# Altium project Project_2_BopIt.PrjPcb
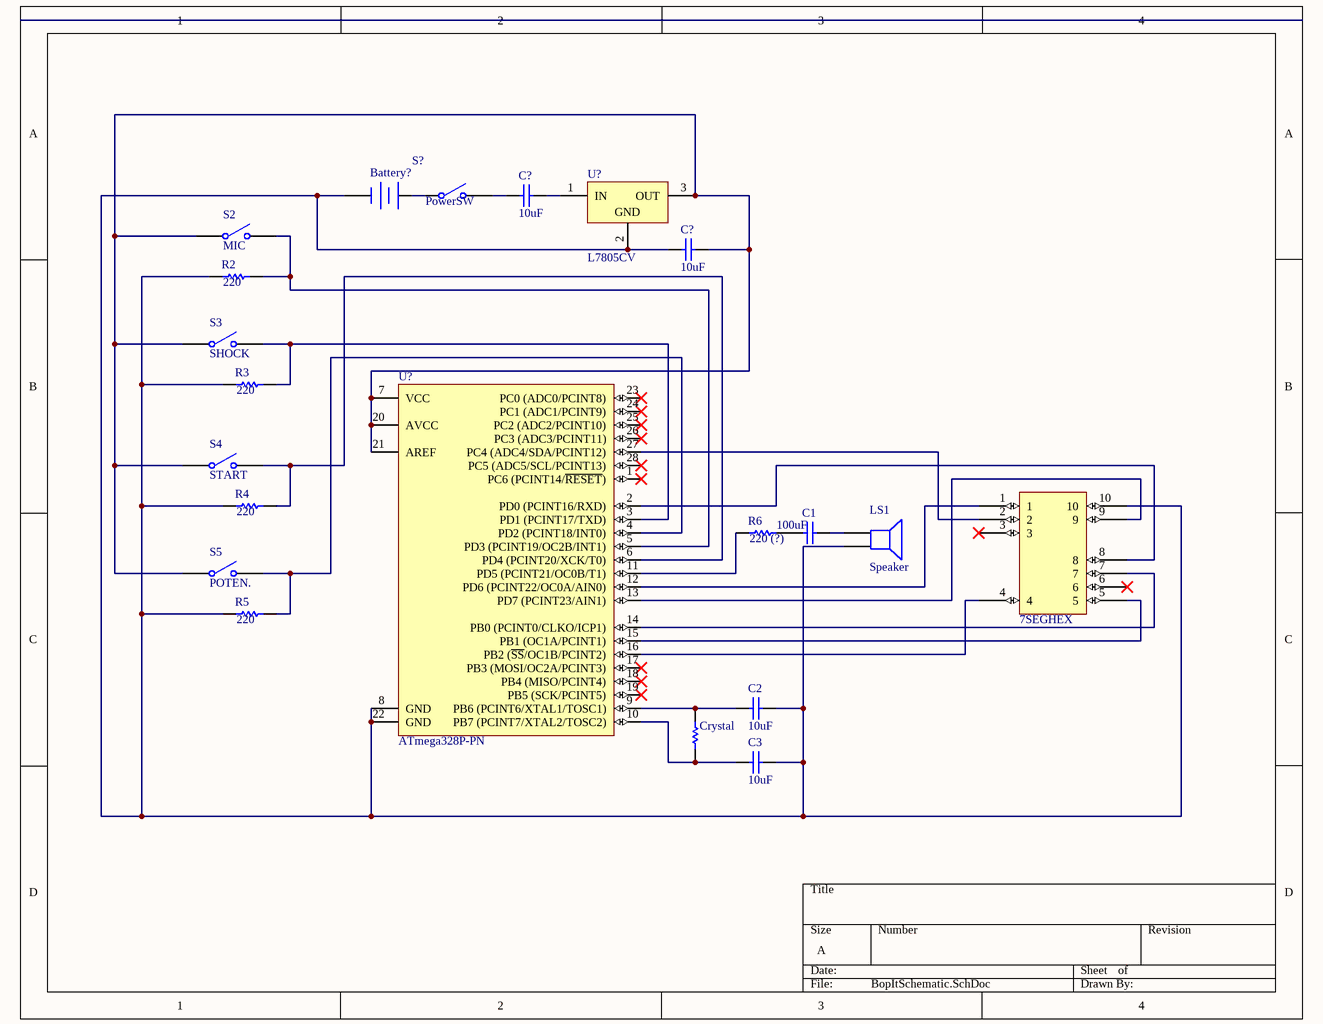
[diagram p0: BopItSchematic.SchDoc]
1 sheet, 21 parts. Net scope: global (net labels, ports and power ports of the same name join across sheets).
Board file: Main.PcbDoc

## Sheet BopItSchematic.SchDoc
size A

### Parts
(Parts that share a designator on the sheet are numbered #1, #2 ... from top to bottom, then left to right.)
7SEGHEX  7SEGHEX  [7SEGHEX]  (value not drawn)
Battery?  (no value)  [BAT-2]
C1  value 100uF  [RAD-0.3]
C2  10uF  [RAD-0.3]
C3  10uF  [RAD-0.3]
C?#1  value 10uF  [RAD-0.3]
C?#2  value 10uF  [RAD-0.3]
Crystal  (no value)  [AXIAL-0.3]
LS1  Speaker  [PIN2]
R2  value 220  [AXIAL-0.3]
R3  value 220  [AXIAL-0.3]
R4  value 220  [AXIAL-0.3]
R5  value 220  [AXIAL-0.3]
R6  value 220 (?)  [AXIAL-0.3]
S2  MIC  [SPST-2]
S3  SHOCK  [SPST-2]
S4  START  [SPST-2]
S5  POTEN.  [SPST-2]
S?  PowerSW  [SPST-2]
U?#1  L7805CV  [TO220]
U?#2  ATmega328P-PN  [28P3]

### Nets
Net7SEGHEX_1: 7SEGHEX.1 U?#2.12(PD6_(PCINT22/OC0A/AIN0))
Net7SEGHEX_2: 7SEGHEX.2 U?#2.27(PC4_(ADC4/SDA/PCINT12))
Net7SEGHEX_4: 7SEGHEX.4 U?#2.16(PB2_(~{SS}/OC1B/PCINT2))
Net7SEGHEX_5: 7SEGHEX.5 U?#2.15(PB1_(OC1A/PCINT1))
Net7SEGHEX_7: 7SEGHEX.7 U?#2.14(PB0_(PCINT0/CLKO/ICP1))
Net7SEGHEX_8: 7SEGHEX.8 U?#2.2(PD0_(PCINT16/RXD))
Net7SEGHEX_9: 7SEGHEX.9 U?#2.13(PD7_(PCINT23/AIN1))
Net7SEGHEX_10: 7SEGHEX.10 Battery?.2(-) C2.2 C3.2 C?#2.2 LS1.2 R2.1 R3.1 R4.1 R5.1 U?#1.2(GND) U?#2.8(GND) U?#2.22(GND)
NetBattery?_1: Battery?.1(+) S?.1(COMMON)
NetC1_1: C1.1 R6.2
NetC1_2: C1.2 LS1.1
NetC2_1: C2.1 Crystal.2 U?#2.9(PB6_(PCINT6/XTAL1/TOSC1))
NetC3_1: C3.1 Crystal.1 U?#2.10(PB7_(PCINT7/XTAL2/TOSC2))
NetC?#1_1: C?#1.1 U?#1.1(IN)
NetC?#1_2: C?#1.2 S?.2(NO)
NetC?#2_1: C?#2.1 S2.1(COMMON) S3.1(COMMON) S4.1(COMMON) S5.1(COMMON) U?#1.3(OUT) U?#2.7(VCC) U?#2.20(AVCC) U?#2.21(AREF)
NetR2_2: R2.2 S2.2(NO) U?#2.5(PD3_(PCINT19/OC2B/INT1))
NetR3_2: R3.2 S3.2(NO) U?#2.3(PD1_(PCINT17/TXD))
NetR4_2: R4.2 S4.2(NO) U?#2.6(PD4_(PCINT20/XCK/T0))
NetR5_2: R5.2 S5.2(NO) U?#2.4(PD2_(PCINT18/INT0))
NetR6_1: R6.1 U?#2.11(PD5_(PCINT21/OC0B/T1))

Not connected (* = marked no-connect by the designer): 7SEGHEX 3* 6*; U?#2 1(PC6_(PCINT14/~{RESET}))* 17(PB3_(MOSI/OC2A/PCINT3))* 18(PB4_(MISO/PCINT4))* 19(PB5_(SCK/PCINT5))* 23(PC0_(ADC0/PCINT8))* 24(PC1_(ADC1/PCINT9))* 25(PC2_(ADC2/PCINT10))* 26(PC3_(ADC3/PCINT11))* 28(PC5_(ADC5/SCL/PCINT13))*

### Library data of the parts
7SEGHEX = 7SEGHEX: 7 segment Hex display
Battery? = Battery: Multicell Battery; Published: 24-Mar-1999; LatestRevisionDate: 17-Jul-2002; LatestRevisionNote: Re-released for DXP Platform.; PackageReference: BAT-2; Publisher: Altium Limited; PackageDescription: Battery; 2 Leads
C1 C?#1 C?#2 = Cap: Capacitor; Published: 8-Jun-2000; LatestRevisionDate: 17-Jul-2002; LatestRevisionNote: Re-released for DXP Platform.; PackageReference: RAD-0.3; Publisher: Altium Limited; PackageDescription: Radial Cap, Thru-Hole; 2 Leads; 0.3 in Pin Spacing
C2 C3 = Cap: Capacitor; Value: 100uF; Published: 8-Jun-2000; LatestRevisionDate: 17-Jul-2002; LatestRevisionNote: Re-released for DXP Platform.; PackageReference: RAD-0.3; Publisher: Altium Limited; PackageDescription: Radial Cap, Thru-Hole; 2 Leads; 0.3 in Pin Spacing
Crystal = Res1: Resistor; Value: 220; Published: 8-Jun-2000; LatestRevisionDate: 17-Jul-2002; LatestRevisionNote: Re-released for DXP Platform.; PackageReference: AXIAL-0.3; Publisher: Altium Limited; PackageDescription: Axial Device, Thru-Hole; 2 Leads; 0.3 in Pin Spacing
LS1 = Speaker: Loudspeaker; Published: 24-Mar-1999; LatestRevisionDate: 17-Jul-2002; LatestRevisionNote: Re-released for DXP Platform.; PackageReference: PIN2; Publisher: Altium Limited
R2-R6 = Res1: Resistor; Published: 8-Jun-2000; LatestRevisionDate: 17-Jul-2002; LatestRevisionNote: Re-released for DXP Platform.; PackageReference: AXIAL-0.3; Publisher: Altium Limited; PackageDescription: Axial Device, Thru-Hole; 2 Leads; 0.3 in Pin Spacing
S2-S5 S? = SW-SPST: Single-Pole, Single-Throw Switch; Published: 24-Mar-1999; LatestRevisionDate: 17-Jul-2002; LatestRevisionNote: Re-released for DXP Platform.; PackageReference: SPST-2; Publisher: Altium Limited; PackageDescription: Switch; 2 Leads
U?#1 = CMP-0244-00483-1: Positive Voltage Regulator, 5V, 3-Pin TO-220; PackageDescription: TO, Thru-Hole, Vertical, Heatsink Mounted; 3 In-Line Leads; Pitch 2.54 mm; ComponentLink2Description: Datasheet; PackageReference: TO220; ComponentLink3URL: http://www.st.com/internet/com/TECHNICAL_RESOURCES/TECHNICAL_LITERATURE/PACKAGE_INFORMATION/CD00004649.pdf; DatasheetVersion: 16/11/2011; ComponentLink1Description: Manufacturer URL; ComponentLink1URL: http://www.st.com; PackageVersion: ver3.0; ComponentLink3Description: Package Specification; ComponentLink2URL: http://www.st.com/internet/com/TECHNICAL_RESOURCES/TECHNICAL_LITERATURE/DATASHEET/CD00000444.pdf
U?#2 = CMP-0095-00355-1: 8-bit AVR Microcontroller, 32KB Flash, 1KB EEPROM, 2KB SRAM, 28-pin PDIP, Industrial Grade (-40°C to 105°C); PackageVersion: revB, Sep-2001; ComponentLink1Description: Manufacturer URL; ComponentLink1URL: http://www.atmel.com/; ComponentLink2URL: http://www.atmel.com/dyn/resources/prod_documents/8271.pdf; PackageDescription: 28-lead (0.300"/7.62mm Wide) Plastic Dual Inline Package (PDIP); ComponentLink2Description: ATmega48A/48PA/88A/88PA/168A/168PA/328/328P Datasheet; ComponentLink3Description: ATmega48A/48PA/88A/88PA/168A/168PA/328/328P Summary; DatasheetVersion: revD, May-2011; ComponentLink3URL: http://www.atmel.com/dyn/resources/prod_documents/8271S.pdf; PackageReference: 28P3